# EAGLE schematic Thetis_RevF3_SCH (EAGLE 9.7.0)
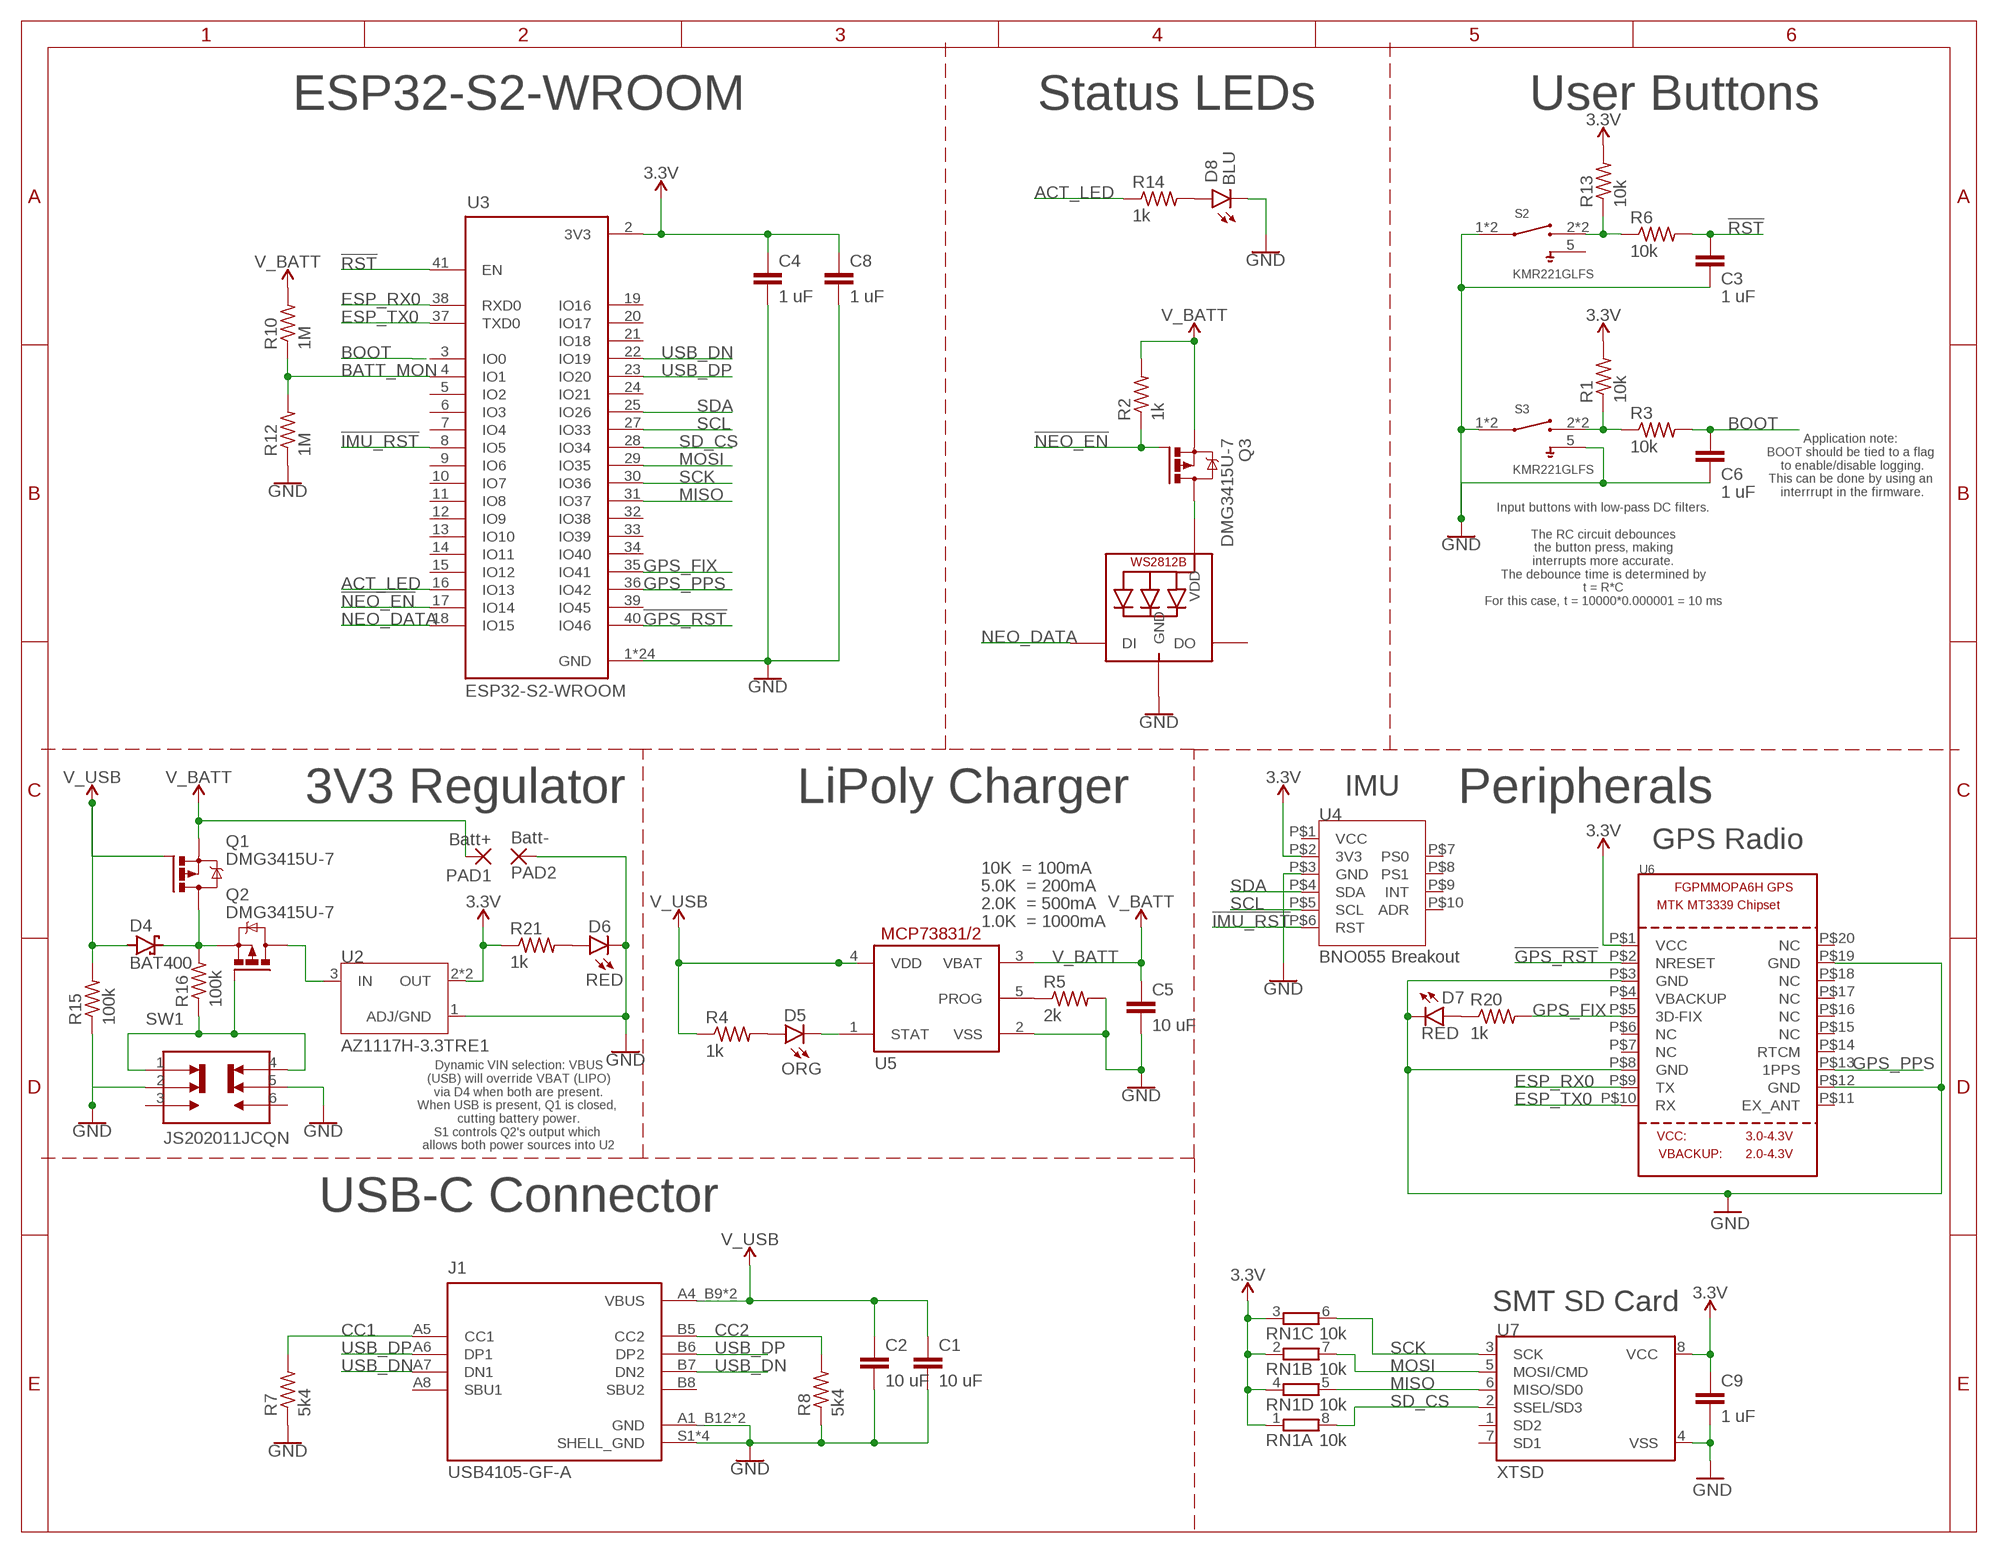
[diagram p0: schematic, sheet 1]

## Parts
C1  10 uF  C-EUC0603  [C0603]
C2  10 uF  C-EUC0603  [C0603]
C3  1 uF  C-EUC0603  [C0603]
C4  1 uF  C-EUC0603  [C0603]
C5  10 uF  C-EUC0603  [C0603]
C6  1 uF  C-EUC0603  [C0603]
C8  1 uF  C-EUC0603  [C0603]
C9  1 uF  C-EUC0603  [C0603]
D4  BAT400  BAS40  [SOT23]
D5  ORG  CHIP-ROUND-G_0603  [LEDC1608X65N]
D6  RED  CHIP-ROUND-G_0603  [LEDC1608X65N]
D7  RED  CHIP-FLAT-Y_0603-0.35MM  [LEDC1608X35N]
D8  BLU  CHIP-ROUND-G_0603  [LEDC1608X65N]
J1  USB4105-GF-A  [GCT_USB4105-GF-A]
LED1  WS2812B3535  [LED3535]
PAD1  Batt+  SMD5  [SMD2,54-5,08]
PAD2  Batt-  SMD5  [SMD2,54-5,08]
Q1  DMG3415U-7  PMOSFET_BSS84  [SOT23]
Q2  DMG3415U-7  PMOSFET_BSS84  [SOT23]
Q3  DMG3415U-7  PMOSFET_BSS84  [SOT23]
R1  10k  R-US_R0603  [R0603]
R2  1k  R-US_R0603  [R0603]
R3  10k  R-US_R0603  [R0603]
R4  1k  R-US_R0603  [R0603]
R5  2k  R-US_R0603  [R0603]
R6  10k  R-US_R0603  [R0603]
R7  5k4  R-US_R0603  [R0603]
R8  5k4  R-US_R0603  [R0603]
R10  1M  R-US_R0603  [R0603]
R12  1M  R-US_R0603  [R0603]
R13  10k  R-US_R0603  [R0603]
R14  1k  R-US_R0603  [R0603]
R15  100k  R-US_R0603  [R0603]
R16  100k  R-US_R0603  [R0603]
R20  1k  R-US_R0603  [R0603]
R21  1k  R-US_R0603  [R0603]
RN1  10k  4R-NEXBN8V  [EXBN8V]
S2  KMR221GLFS  [SW_KMR221GLFS]
S3  KMR221GLFS  [SW_KMR221GLFS]
SW1  JS202011JCQN  [SW_JS202011JCQN]
U2  AZ1117H-3.3TRE1  AZ1117EH-5.0TRG1  [SOT230P700X180-4N]
U3  ESP32-S2-WROOM  [XCVR_ESP32-S2-WROOM]
U4  BNO055 Breakout  ADAFRUIT-BNO055-BREAKOUT-SMD  [ADAFRUIT-BNO055-BREAKOUT-SMD]
U5  MCP73831/OT  [SOT23-5L]
U6  GPS_FGPMMOPA6H  [FGPMMOPA6H]
U7  XTSD  SMT_SDCARD_8PIN  [LGA8_8X6]

## Nets
3.3V: C4.1 C8.1 C9.1 R1.2 R13.2 R21.1 RN1.1 RN1.2 RN1.3 RN1.4 U2.2(OUT) U2.4(OUT) U3.2(3V3) U4.P$2(3V3) U6.P$1(VCC) U7.8(VCC)
!GPS_RST: U3.40(IO46) U6.P$2(NRESET)
!IMU_RST: U3.8(IO5) U4.P$6(RST)
!NEO_EN: Q3.1(G) R2.1 U3.17(IO14)
!RST: C3.1 R6.2 U3.41(EN)
ACT_LED: R14.1 U3.16(IO13)
BATT_MON: R10.1 R12.2 U3.4(IO1)
BOOT: C6.1 R3.2 U3.3(IO0)
CC1: J1.A5(CC1) R7.2
CC2: J1.B5(CC2) R8.2
ESP_RX0: U3.38(RXD0) U6.P$9(TX)
ESP_TX0: U3.37(TXD0) U6.P$10(RX)
GND: C1.2 C2.2 C3.2 C4.2 C5.2 C6.2 C8.2 C9.2 D6.C D7.C D8.C J1.A1_B12(GND) J1.B1_A12(GND) J1.S1(SHELL_GND) J1.S2(SHELL_GND) J1.S3(SHELL_GND) J1.S4(SHELL_GND) LED1.4(GND) PAD2.1(P) R5.2 R7.1 R8.1 R12.1 R15.1 S2.1 S2.4 S3.1 S3.4 S3.5 SW1.2 SW1.5 U2.1(ADJ/GND) U3.1(GND) U3.26(GND) U3.42(GND) U3.43.1(GND) U3.43.2(GND) U3.43.3(GND) U3.43.4(GND) U3.43.5(GND) U3.43.6(GND) U3.43.7(GND) U3.43.8(GND) U3.43.9(GND) U3.43.10(GND) U3.43.11(GND) U3.43.12(GND) U3.43.13(GND) U3.43.14(GND) U3.43.15(GND) U3.43.16(GND) U3.43.17(GND) U3.43.18(GND) U3.43.19(GND) U3.43.20(GND) U3.43.21(GND) U4.P$3(GND) U5.2(VSS) U6.P$3(GND) U6.P$8(GND) U6.P$12(GND) U6.P$19(GND) U7.4(VSS)
GPS_FIX: R20.2 U3.35(IO41) U6.P$5(3D-FIX)
GPS_PPS: U3.36(IO42) U6.P$13(1PPS)
MISO: RN1.5 U3.31(IO37) U7.6(MISO/SD0)
MOSI: RN1.7 U3.29(IO35) U7.5(MOSI/CMD)
N$1: Q2.1(G) R16.1 SW1.1 SW1.4
N$2: D7.A R20.1
N$3: D8.A R14.2
N$4: R6.1 R13.1 S2.2 S2.3
N$5: LED1.2(VDD) Q3.3(D)
N$6: Q2.3(D) U2.3(IN)
N$7: R1.1 R3.1 S3.2 S3.3
N$13: D4.3(C) Q1.3(D) Q2.2(S) R16.2
N$20: D5.A R4.2
N$21: D5.C U5.1(STAT)
N$22: R5.1 U5.5(PROG)
N$24: D6.A R21.2
NEO_DATA: LED1.1(DI) U3.18(IO15)
SCK: RN1.6 U3.30(IO36) U7.3(SCK)
SCL: U3.27(IO33) U4.P$5(SCL)
SD_CS: RN1.8 U3.28(IO34) U7.2(SSEL/SD3)
SDA: U3.25(IO26) U4.P$4(SDA)
USB_DN: J1.A7(DN1) J1.B7(DN2) U3.22(IO19)
USB_DP: J1.A6(DP1) J1.B6(DP2) U3.23(IO20)
V_BATT: C5.1 PAD1.1(P) Q1.2(S) Q3.2(S) R2.2 R10.2 U5.3(VBAT)
V_USB: C1.1 C2.1 D4.1(A) J1.A4_B9(VBUS) J1.B4_A9(VBUS) Q1.1(G) R4.1 R15.2 U5.4(VDD)
Unconnected: J1.A8(SBU1) J1.B8(SBU2) LED1.3(DO) S2.5 SW1.3 SW1.6 U3.5(IO2) U3.6(IO3) U3.7(IO4) U3.9(IO6) U3.10(IO7) U3.11(IO8) U3.12(IO9) U3.13(IO10) U3.14(IO11) U3.15(IO12) U3.19(IO16) U3.20(IO17) U3.21(IO18) U3.24(IO21) U3.32(IO38) U3.33(IO39) U3.34(IO40) U3.39(IO45) U4.P$7(PS0) U4.P$8(PS1) U4.P$9(INT) U4.P$10(ADR) U6.P$4(VBACKUP) U6.P$6(NC) U6.P$7(NC) U6.P$11(EX_ANT) U6.P$14(RTCM) U6.P$15(NC) U6.P$16(NC) U6.P$17(NC) U6.P$18(NC) U6.P$20(NC) U7.1(SD2) U7.7(SD1)

## Notes on the sheet
- ESP32-S2-WROOM | Status LEDs | User Buttons
- Application note: 
  BOOT should be tied to a flag 
  to enable/disable logging.
  This can be done by using an 
  interrrupt in the firmware.
- Input buttons with low-pass DC filters.
  
  The RC circuit debounces
  the button press, making
  interrupts more accurate.
  The debounce time is determined by
  t = R*C
  For this case, t = 10000*0.000001 = 10 ms
- 3V3 Regulator | LiPoly Charger | IMU | Peripherals
- GPS Radio
- 10K  = 100mA
- 5.0K  = 200mA
- 2.0K  = 500mA
- 1.0K  = 1000mA
- Dynamic VIN selection: VBUS
  (USB) will override VBAT (LIPO)
  via D4 when both are present.
  When USB is present, Q1 is closed, 
  cutting battery power.
  S1 controls Q2's output which 
  allows both power sources into U2
- USB-C Connector
- SMT SD Card

## Power pins joined to a net without a drawn wire
VCC: U4.P$1(VCC)

## Library data of the parts
C1-C6 C8 C9 = rcl:C-EU: CAPACITOR, European symbol; SPICEPREFIX: C
D4 = diode:BAS40: Silicon Schottky Diodes General-purpose diode for high-speed switching
D5 D6 D8 = LED:CHIP-ROUND-G; CATEGORY: LED; COLOR: GREEN; DESCRIPTION: CHIP LED ROUND; SUB-CATEGORY: CHIP; TYPE: ROUND_TOP
D7 = LED:CHIP-FLAT-Y; CATEGORY: LED; COLOR: YELLOW; DESCRIPTION: CHIP LED FLAT; SUB-CATEGORY: CHIP; TYPE: FLAT_TOP
J1 = USB4105-GF-A:USB4105-GF-A: USB-C (USB TYPE-C) USB 2.0 Receptacle Connector 24 (16+8 Dummy) Position Surface Mount, Right Angle; Through Hole Check prices <https://pricing.snapeda.com/parts/USB4105-GF-A/GCT/view-part?ref=eda>; AVAILABILITY: In Stock; DESCRIPTION: USB-C (USB TYPE-C) USB 2.0 Receptacle Connector 24 (16+8 Dummy) Position Surface Mount, Right Angle; Through Hole; MF: GCT; MP: USB4105-GF-A; PACKAGE: None; PRICE: None; PURCHASE-URL: https://pricing.snapeda.com/search/part/USB4105-GF-A/?ref=eda
LED1 = adafruit:WS2812B
PAD1 PAD2 = wirepad:SMD5: SMD PAD
Q1-Q3 = Transistor:PMOSFET_: P-Channel MOSFET - Popular parts; CATEGORY: Transistor; DESCRIPTION: MOSFET P-CH 50V 130MA SOT-23; DRAIN_CURRENT: 130mA; MANUFACTURER: ON Semiconductor; MPN: BSS84; OPERATING_TEMP: -55°C ~ 150°C; PART_STATUS: Active; ROHS_COMPLIANT: Yes; SUB-CATEGORY: MOSFET; THERMALLOSS: 360mW; TYPE: P-Channel; VALUE: BSS84
R1-R8 R10 R12-R16 R20 R21 = rcl:R-US_: RESISTOR, American symbol; SPICEPREFIX: R
RN1 = resistor-dil-Poseidon-Edit:4R-N: Array Chip Resistor Source: RS Component / Phycomp; OC_FARNELL: unknown; OC_NEWARK: unknown
S2 S3 = KMR221GLFS:KMR221GLFS: Switch Tactile N.O. SPST Button Gull Wing 0.05A 32VDC 1VA 200000Cycles 2N SMD Automotive T/R; MANUFACTURER: CnK
SW1 = UTL-Lib:JS202011JCQN
U2 = AZ1117EH-5.0TRG1:AZ1117EH-5.0TRG1; ARROW_ELECTRONICS-PURCHASE-URL: https://snapeda.com/shop?store=Arrow+Electronics&id=482930; AVAILABILITY: Good; DESCRIPTION: Linear Voltage Regulator IC 1 Output 1A SOT-223; DIGIKEY-PURCHASE-URL: https://snapeda.com/shop?store=DigiKey&id=482930; MF: Diodes Inc.; MOUSER-PURCHASE-URL: https://snapeda.com/shop?store=Mouser&id=482930; MP: AZ1117EH-5.0TRG1; PACKAGE: SOT-223 Diodes Inc.; PRICE: None
U3 = ESP32-S2-WROOM:ESP32-S2-WROOM: WiFi 802.11b/g/n Transceiver Module 2.4GHz PCB Trace Surface Mount; MANUFACTURER: Espressif Systems; MAXIMUM_PACKAGE_HEIGHT: 3.45mm; PARTREV: V1.0; STANDARD: Manufacturer Recommendations
U4 = EVE-ECAD-Library:ADAFRUIT-BNO055-BREAKOUT
U5 = adafruit - EVE Edit:MCP73831: MCP73831/2 Miniature Single-Cell, Fully Integrated Li-Ion, Li-Polymer Charge Management Controllers. Nice and small simple lipoly charge controller, with adjustable current and status output (LED) http://www.ladyada.net/library/pcb/eaglelibrary.html
U6 = adafruit - EVE Edit:GPS_FGPMMOPA6H: GPS Module - MTK MT3339 Chipset, -165dBm sensitivity, 22 channels, 10Hz, auto-select external antenna options
U7 = microbuilder:SMT_SDCARD_8PIN: SOIC8 SPI Flash Be careful with the size since SOIC8 flash comes in several 'widths' SOIC8 150 mil M25P16 - 16Mbit (2Mbit x 8) Serial Flash (75MHz SPI Bus), Supply: 2.7-3.6V Digikey: SOIC8 - M25P16-VMN6P-ND SOIC8 208 mil W25Q16BVSSIG - 16Mbit (2Mbit x 8) Serial Flash (104MHz SPI Bus), Supply: 2.7-3.6V Digikey: SOIC8 - W25Q16BVSSIG-ND

## Net classes
0 default: width 0.178 mm
2 lowpower: width 0.305 mm, drill 0.483 mm